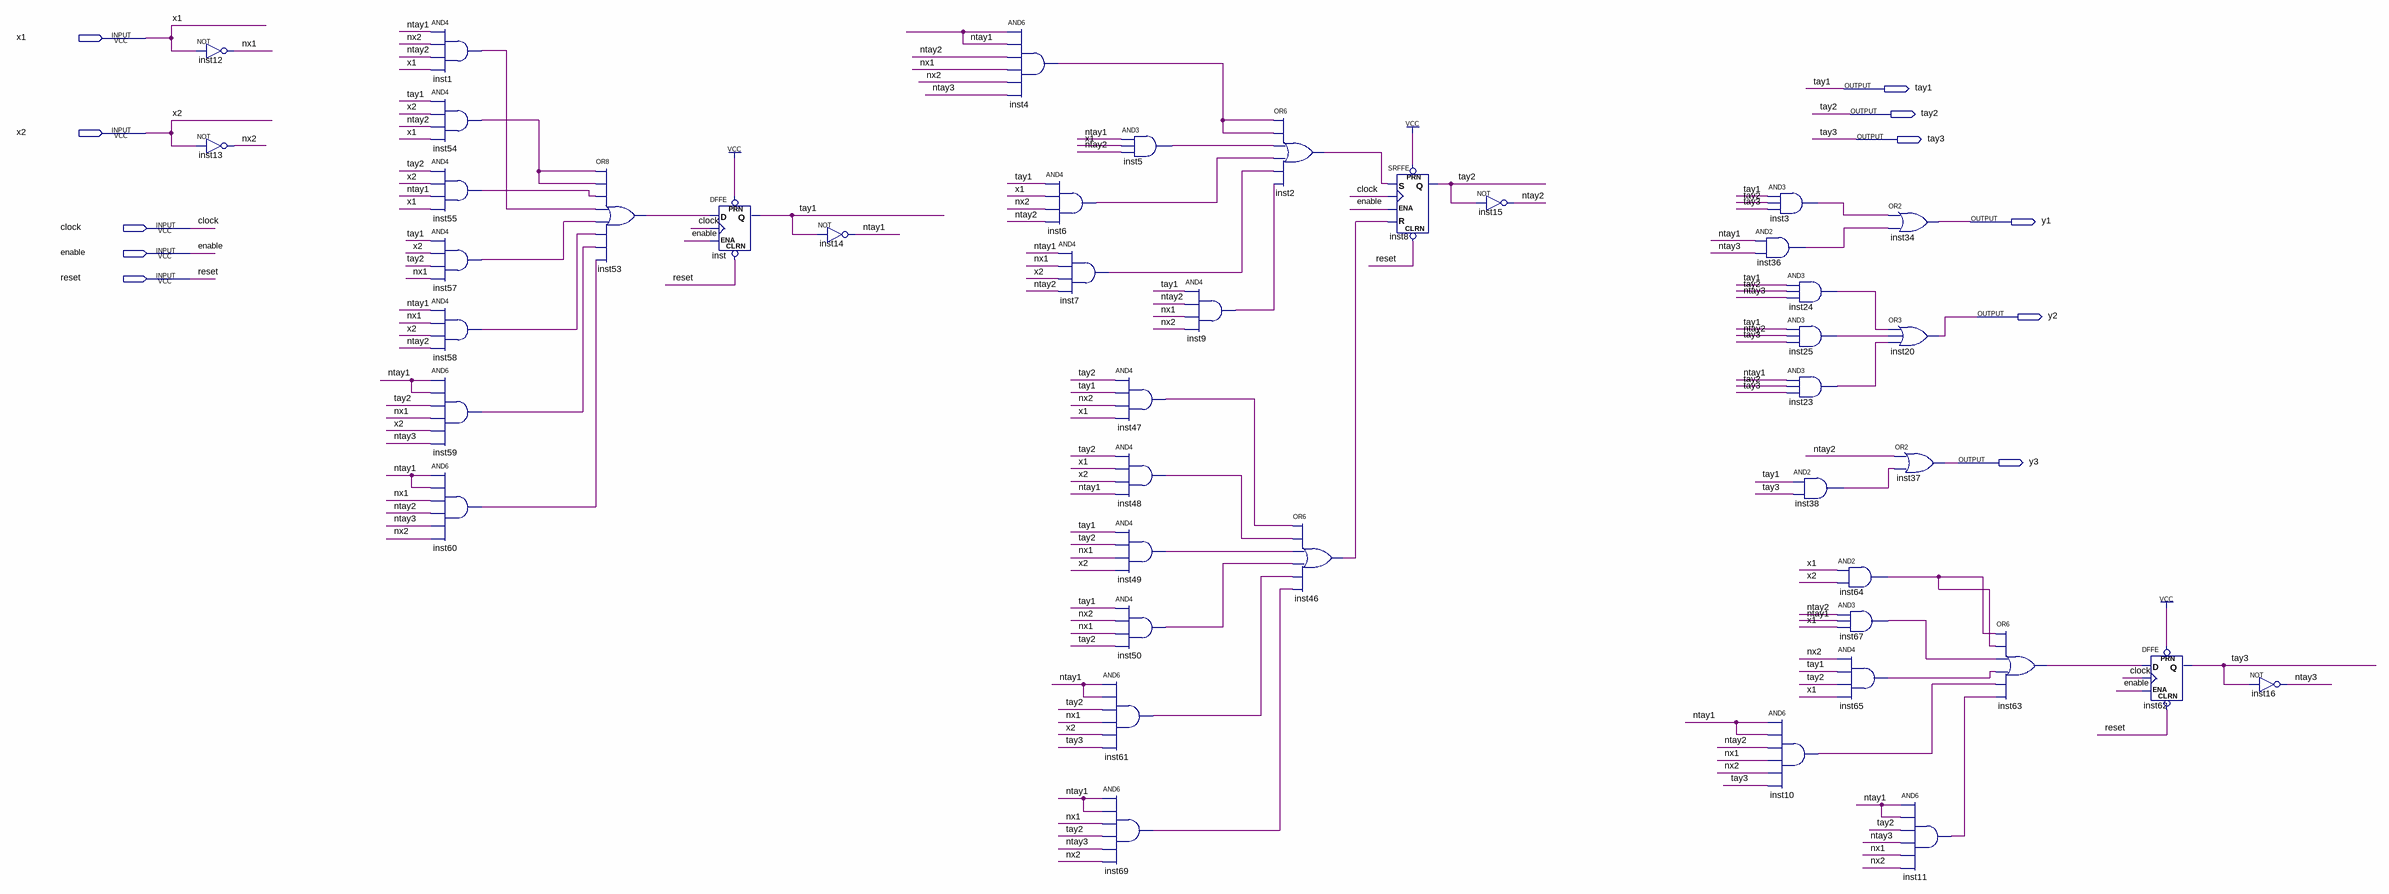
[diagram p0: schematic sheet]
// Quartus schematic avtomat_myra.bdf as structural Verilog: 44 symbols, 11 pins
module avtomat_myra (
  input  x1,
  input  x2,
  input  clock,
  input  enable,
  input  reset,
  output tay1,
  output tay2,
  output tay3,
  output y1,
  output y2,
  output y3
);

  wire inst1_out, inst2_out, inst3_out, inst4_out, inst5_out, inst6_out, inst7_out, inst9_out, inst10_out,
       inst11_out, inst23_out, inst24_out, inst25_out, inst36_out, inst38_out, inst46_out, inst47_out,
       inst48_out, inst49_out, inst50_out, inst53_out, inst54_out, inst55_out, inst57_out, inst58_out,
       inst59_out, inst60_out, inst61_out, inst63_out, inst64_out, inst65_out, inst67_out, inst69_out, ntay1,
       ntay2, ntay3, nx1, nx2;

  not inst12 (nx1, x1);
  not inst13 (nx2, x2);
  and inst1 (inst1_out, ntay1, nx2, ntay2, x1);
  and inst54 (inst54_out, tay1, x2, ntay2, x1);
  and inst55 (inst55_out, tay2, x2, ntay1, x1);
  and inst57 (inst57_out, tay1, x2, tay2, nx1);
  and inst58 (inst58_out, ntay1, nx1, x2, ntay2);
  and inst59 (inst59_out, ntay1, ntay1, tay2, nx1, x2, ntay3);
  and inst60 (inst60_out, ntay1, ntay1, nx1, ntay2, ntay3, nx2);
  or inst53 (inst53_out, inst54_out, inst54_out, inst55_out, inst1_out, inst57_out, inst58_out, inst59_out, inst60_out);
  DFFE inst (.PRN(1'b1), .CLRN(reset), .D(inst53_out), .CLK(clock), .ENA(enable), .Q(tay1));
  not inst14 (ntay1, tay1);
  and inst4 (inst4_out, ntay1, ntay1, ntay2, nx1, nx2, ntay3);
  and inst6 (inst6_out, tay1, x1, nx2, ntay2);
  and inst7 (inst7_out, ntay1, nx1, x2, ntay2);
  and inst5 (inst5_out, ntay1, x1, ntay2);
  and inst47 (inst47_out, tay2, tay1, nx2, x1);
  and inst48 (inst48_out, tay2, x1, x2, ntay1);
  and inst49 (inst49_out, tay1, tay2, nx1, x2);
  and inst50 (inst50_out, tay1, nx2, nx1, tay2);
  and inst61 (inst61_out, ntay1, ntay1, tay2, nx1, x2, tay3);
  and inst69 (inst69_out, ntay1, ntay1, nx1, tay2, ntay3, nx2);
  and inst9 (inst9_out, tay1, ntay2, nx1, nx2);
  or inst2 (inst2_out, inst4_out, inst4_out, inst5_out, inst6_out, inst7_out, inst9_out);
  or inst46 (inst46_out, inst47_out, inst48_out, inst49_out, inst50_out, inst61_out, inst69_out);
  SRFFE inst8 (.PRN(1'b1), .S(inst2_out), .CLK(clock), .CLRN(reset), .R(inst46_out), .ENA(enable), .Q(tay2));
  not inst15 (ntay2, tay2);
  and inst3 (inst3_out, tay1, tay2, tay3);
  and inst36 (inst36_out, ntay1, ntay3);
  and inst24 (inst24_out, tay1, tay2, ntay3);
  and inst25 (inst25_out, tay1, ntay2, tay3);
  and inst23 (inst23_out, ntay1, tay2, tay3);
  and inst38 (inst38_out, tay1, tay3);
  and inst10 (inst10_out, ntay1, ntay1, ntay2, nx1, nx2, tay3);
  and inst64 (inst64_out, x1, x2);
  and inst67 (inst67_out, ntay2, ntay1, x1);
  and inst65 (inst65_out, nx2, tay1, tay2, x1);
  or inst34 (y1, inst3_out, inst36_out);
  or inst20 (y2, inst24_out, inst25_out, inst23_out);
  or inst37 (y3, ntay2, inst38_out);
  and inst11 (inst11_out, ntay1, ntay1, tay2, ntay3, nx1, nx2);
  or inst63 (inst63_out, inst64_out, inst64_out, inst67_out, inst65_out, inst10_out, inst11_out);
  DFFE inst62 (.PRN(1'b1), .CLRN(reset), .D(inst63_out), .CLK(clock), .ENA(enable), .Q(tay3));
  not inst16 (ntay3, tay3);
endmodule
